# Altium schematic sheet sch_Sheet_1_2021-12-24.schdoc
size 422 x 246 mm
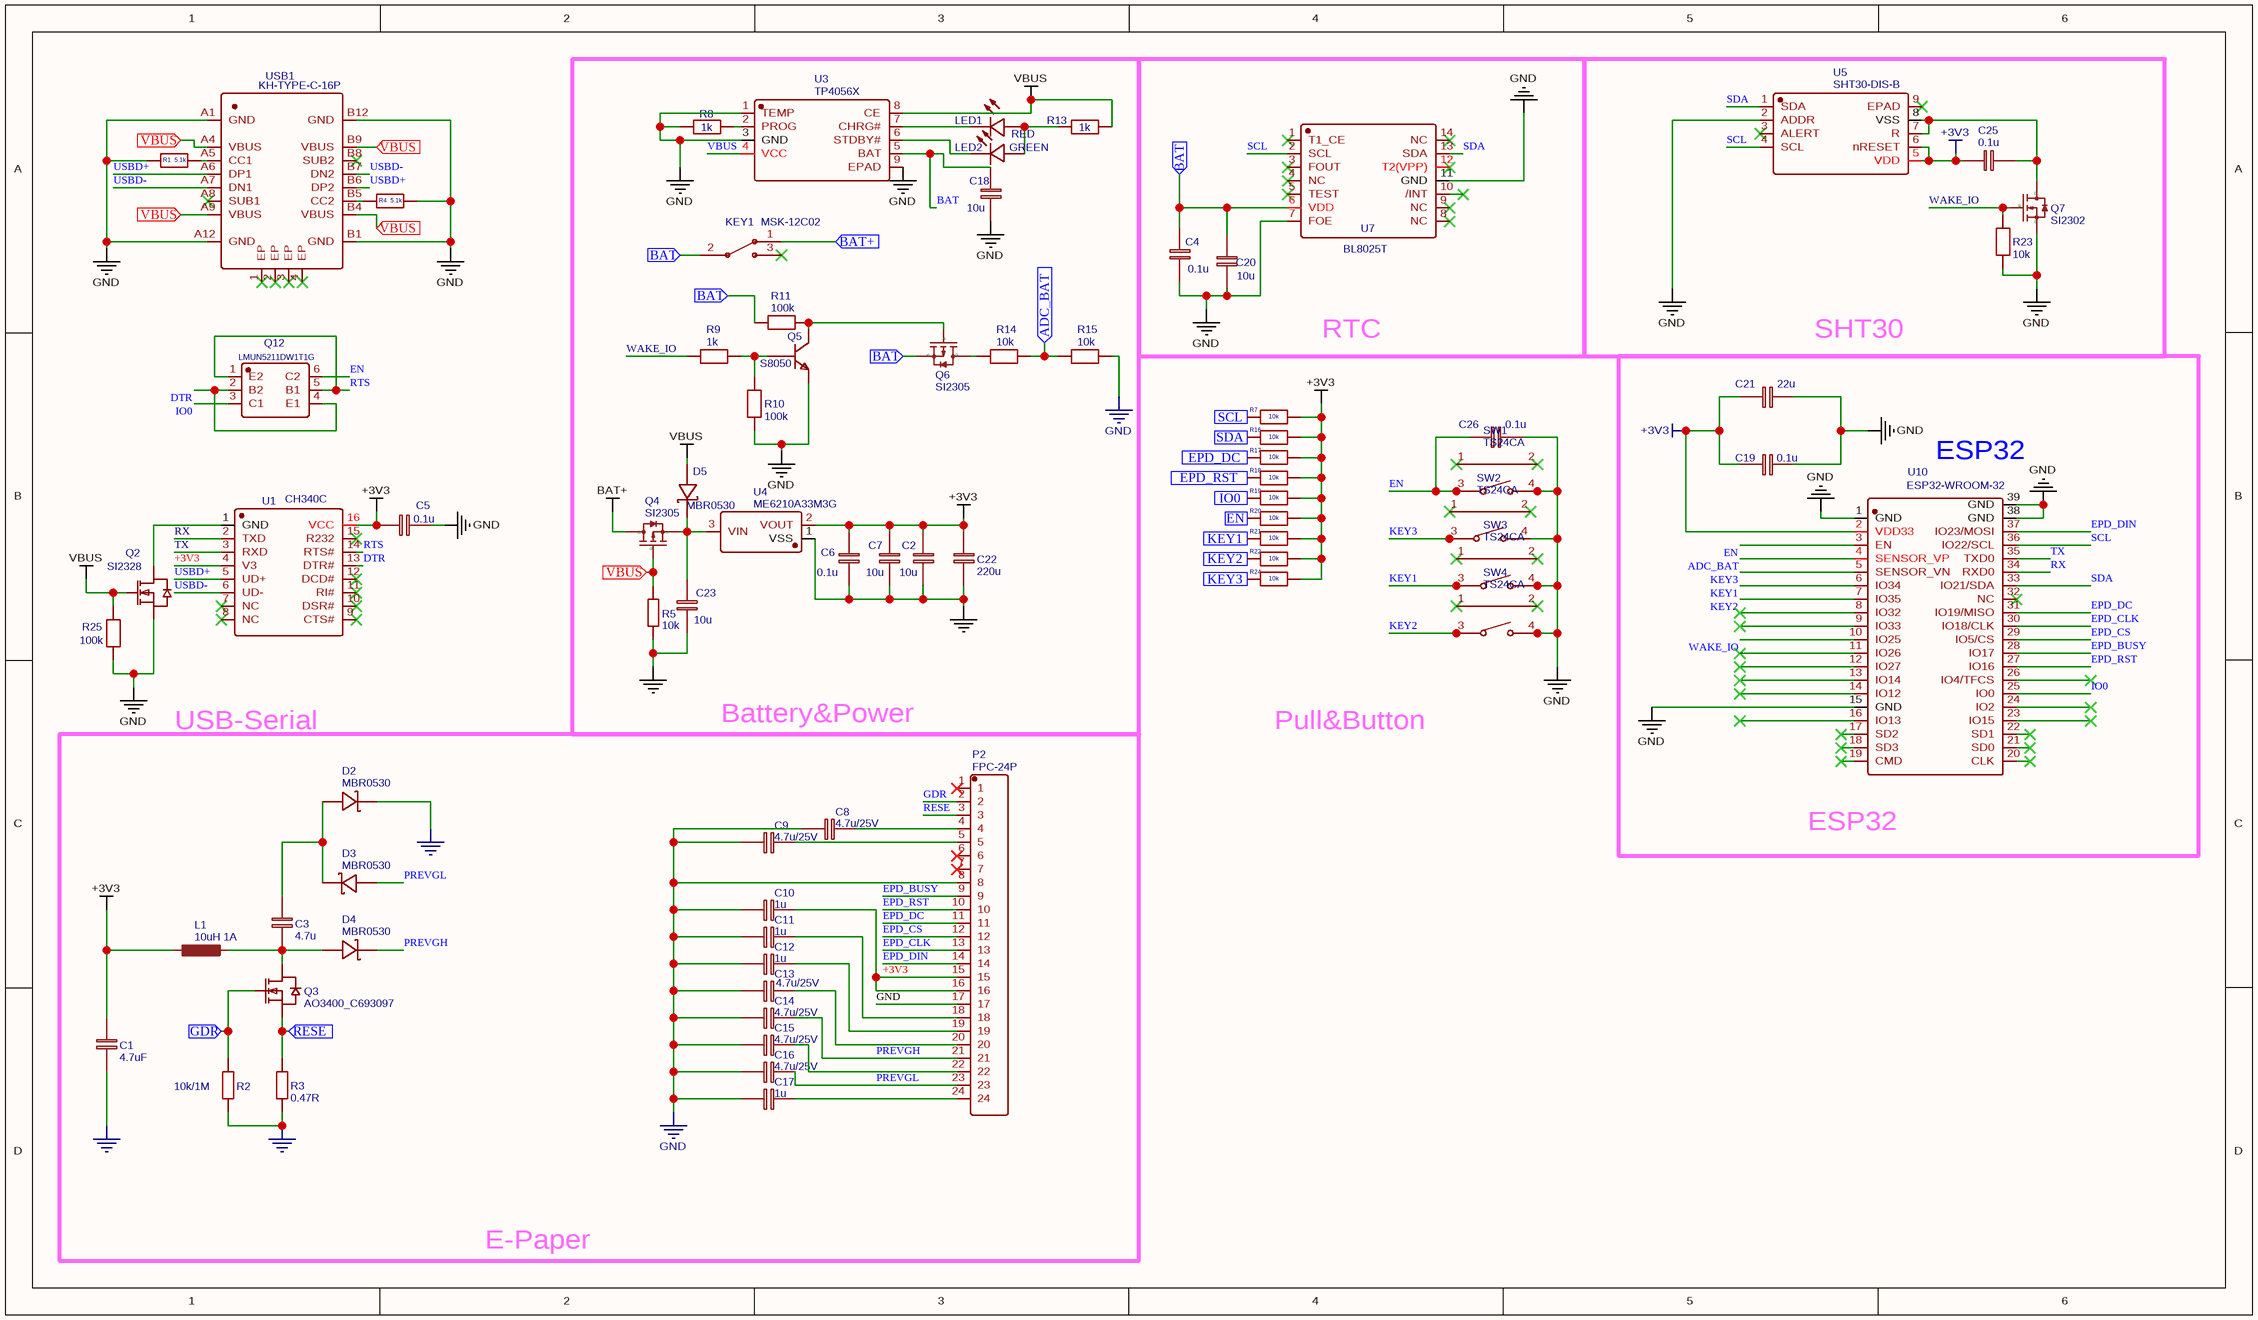
[diagram p0: sch_Sheet_1_2021-12-24.schdoc]

## Parts
C1  4.7uF  [C0603]
C2  10u  [C0603]
C3  4.7u  [C0603]
C4  0.1u  [C0603]
C5  0.1u  [C0603]
C6  0.1u  [C0603]
C7  10u  [C0603]
C8  4.7u/25V  [C0603]
C9  4.7u/25V  [C0603]
C10  1u  [C0603]
C11  1u  [C0603]
C12  1u  [C0603]
C13  4.7u/25V  [C0603]
C14  4.7u/25V  [C0603]
C15  4.7u/25V  [C0603]
C16  4.7u/25V  [C0603]
C17  1u  [C0603]
C18  10u  [C0603]
C19  0.1u  [C0603]
C20  10u  [C0603]
C21  22u  [C0603]
C22  220u  [CASE-B_3528]
C23  10u  [C0603]
C25  0.1u  [C0603]
C26  0.1u  [C0603]
D2  MBR0530  [SOD-123]
D3  MBR0530  [SOD-123]
D4  MBR0530  [SOD-123]
D5  MBR0530  [SOD-123]
KEY1  MSK-12C02  [MSK-11027]
L1  10uH 1A  [C-CD32电感]
LED1  RED  [LED0603-R-RD]
LED2  GREEN  [LED0603-R-RD]
P2  FPC-24P  [FPC-0.5MM-LSSJ-H2.0-24P]
Q2  SI2328  [SOT-23_L2.9-W1.3-P1.90-LS2.4-BR]
Q3  AO3400_C693097  [SOT-23-3_L2.9-W1.6-P1.90-LS2.8-BR]
Q4  SI2305  [SOT-23-3_L2.9-W1.3-P1.90-LS2.4-BR]
Q5  S8050  [SOT-23(SOT-23-3)]
Q6  SI2305  [SOT-23-3_L2.9-W1.3-P1.90-LS2.4-BR]
Q7  SI2302  [SOT-23-3_L2.9-W1.3-P1.90-LS2.4-BR]
Q12  LMUN5211DW1T1G  [SC-88-6_L2.0-W1.3-P0.65-LS2.1-BL]
R1  5.1k  [R0603]
R2  10k/1M  [R0603]
R3  0.47R  [R0603]
R4  5.1k  [R0603]
R5  10k  [R0603]
R7  10k  [R0603]
R8  1k  [R0603]
R9  1k  [R0603]
R10  100k  [R0603]
R11  100k  [R0603]
R13  1k  [R0603]
R14  10k  [R0603]
R15  10k  [R0603]
R16  10k  [R0603]
R17  10k  [R0603]
R18  10k  [R0603]
R19  10k  [R0603]
R20  10k  [R0603]
R21  10k  [R0603]
R22  10k  [R0603]
R23  10k  [R0603]
R24  10k  [R0603]
R25  100k  [R0603]
SW1  TS24CA  [SW-SMD_TS24CA]
SW2  TS24CA  [SW-SMD_TS24CA]
SW3  TS24CA  [SW-SMD_TS24CA]
SW4  TS24CA  [SW-SMD_TS24CA]
U1  CH340C  [SOP-16_150MIL]
U3  TP4056X  [SOP-8_L4.9-W3.9-P1.27-LS6.0-BL-EP]
U4  ME6210A33M3G  [SOT-23-3_L3.0-W1.7-P0.95-LS2.9-BR]
U5  SHT30-DIS-B  [DFN-8_L2.5-W2.5-P0.50-BL-EP]
U7  BL8025T  [SOP-14_L10.3-W5.3-P1.27-LS7.8-BL]
U10  ESP32-WROOM-32  [WIFIM-SMD_39P-L25.5-W18.0-P1.27]
USB1  KH-TYPE-C-16P  [USB-C-SMD_KH-TYPE-C-16P]

## Blocks framed on the sheet
Battery&Power: C2 C6 C7 C18 C22 C23 D5 KEY1 LED1 LED2 Q4-Q6 R5 R8-R11 R13-R15 U3 U4
RTC: C4 C20 U7
SHT30: C25 Q7 R23 U5

## Ports
ADC_BAT (in), BAT (in), BAT+ (in), EN (in), EPD_DC (in), EPD_RST (in), GDR (in), IO0 (in), KEY1 (in), KEY2 (in), KEY3 (in), RESE (in), SCL (in), SDA (in), VBUS (in)

## Nets
+3V3: C1.1 C2.1 C5.2 C6.1 C7.1 C10.1 C19.2 C21.2 C22.1 C25.1 L1.1 P2.15 P2.16 R7.2 R16.2 R17.2 R18.2 R19.2 R20.2 R21.2 R22.2 R24.2 U1.4(V3) U1.16(VCC) U4.2(VOUT) U5.5(VDD) U5.6(nRESET) U10.2(VDD33)
BAT+: Q4.3(D)
GND: C1.2 C2.2 C4.2 C5.1 C6.2 C7.2 C8.2 C9.2 C10.2 C11.2 C12.2 C13.2 C14.2 C15.2 C16.2 C17.2 C18.2 C19.1 C20.2 C21.1 C22.2 C23.2 C26.2 D2.2(K) P2.8 P2.17 Q2.2(S) Q5.2(E) Q7.2(S) R1.1 R2.2 R3.1 R4.2 R5.2 R8.2 R10.1 R15.2 R23.1 R25.1 SW1.4 SW2.4 SW3.4 SW4.4 U3.1(TEMP) U3.3(GND) U3.9(EPAD) U4.1(VSS) U5.2(ADDR) U7.7(FOE) U7.11(GND) U10.1(GND) U10.15(GND) U10.38(GND) U10.39(GND) USB1.A1(GND) USB1.A12(GND) USB1.B1(GND) USB1.B12(GND)
VBUS: D5.1(A) Q2.1(G) R13.2 R25.2 U3.4(VCC) U3.8(CE)
ADC_BAT: R14.2 R15.1 ; port ADC_BAT
ADC_BAT: U10.4(SENSOR_VP)  [a separate net that carries the same name]
BAT: C18.1 U3.5(BAT)
BAT: C4.1 C20.1 KEY1.2 Q6.2(S) R11.2 U7.6(VDD) ; port BAT  [a separate net that carries the same name]
BAT+: KEY1.1 ; port BAT+  [a separate net that carries the same name]
DTR: Q12.2(B2) Q12.4(E1) U1.13(DTR#)
EN: C26.1 Q12.6(C2) SW1.3 U10.3(EN)
EN: R20.1 ; port EN  [a separate net that carries the same name]
EPD_BUSY: P2.9 U10.28(IO17)
EPD_CLK: P2.13 U10.30(IO18/CLK)
EPD_CS: P2.12 U10.29(IO5/CS)
EPD_DC: P2.11 U10.31(IO19/MISO)
EPD_DC: R17.1 ; port EPD_DC  [a separate net that carries the same name]
EPD_DIN: P2.14 U10.37(IO23/MOSI)
EPD_RST: P2.10 U10.27(IO16)
EPD_RST: R18.1 ; port EPD_RST  [a separate net that carries the same name]
GDR: P2.2
GDR: Q3.1(G) R2.1 ; port GDR  [a separate net that carries the same name]
IO0: Q12.3(C1) U10.25(IO0)
IO0: R19.1 ; port IO0  [a separate net that carries the same name]
KEY1: SW3.3 U10.6(IO34)
KEY1: R21.1 ; port KEY1  [a separate net that carries the same name]
KEY2: SW4.3 U10.7(IO35)
KEY2: R22.1 ; port KEY2  [a separate net that carries the same name]
KEY3: SW2.3 U10.5(SENSOR_VN)
KEY3: R24.1 ; port KEY3  [a separate net that carries the same name]
PREVGH: C14.1 D4.2(K) P2.21
PREVGL: C16.1 D3.1(A) P2.23
RESE: P2.3
RESE: Q3.2(S) R3.2 ; port RESE  [a separate net that carries the same name]
RTS: Q12.1(E2) Q12.5(B1) U1.14(RTS#)
RX: U1.2(TXD) U10.34(RXD0)
SCL: U5.4(SCL) U7.2(SCL) U10.36(IO22/SCL)
SCL: R7.1 ; port SCL  [a separate net that carries the same name]
SDA: U5.1(SDA) U7.13(SDA) U10.33(IO21/SDA)
SDA: R16.1 ; port SDA  [a separate net that carries the same name]
TX: U1.3(RXD) U10.35(TXD0)
USBD+: U1.5(UD+) USB1.A6(DP1) USB1.B6(DP2)
USBD-: U1.6(UD-) USB1.A7(DN1) USB1.B7(DN2)
VBUS: Q4.1(G) R5.1 USB1.A4(VBUS) USB1.A9(VBUS) USB1.B4(VBUS) USB1.B9(VBUS) ; port VBUS  [a separate net that carries the same name]
WAKE_IO: Q7.1(G) R9.2 R23.2 U10.10(IO25)
NetC3_1: C3.1 D2.1(A) D3.2(K)
NetC3_2: C3.2 D4.1(A) L1.2 Q3.3(D)
NetC8_1: C8.1 P2.4
NetC9_1: C9.1 P2.5
NetC11_1: C11.1 P2.18
NetC12_1: C12.1 P2.19
NetC13_1: C13.1 P2.20
NetC15_1: C15.1 P2.22
NetC17_1: C17.1 P2.24
NetC23_1: C23.1 D5.2(K) Q4.2(S) U4.3(VIN)
NetC25_2: C25.2 Q7.3(D) U5.7(R) U5.8(VSS)
NetLED1_1: LED1.1(+) LED2.1(A) R13.1
NetLED1_2: LED1.2(-) U3.7(CHRG#)
NetLED2_2: LED2.2(K) U3.6(STDBY#)
NetQ2_3: Q2.3(D) U1.1(GND)
NetQ5_1: Q5.1(B) R9.1 R10.2
NetQ5_3: Q5.3(C) Q6.1(G) R11.1
NetQ6_3: Q6.3(D) R14.1
NetR1_2: R1.2 USB1.A5(CC1)
NetR4_1: R4.1 USB1.B5(CC2)
NetR8_1: R8.1 U3.2(PROG)

Not connected (* = marked no-connect by the designer): KEY1 3*; P2 1* 6* 7*; SW1 1* 2*; SW2 1* 2*; SW3 1* 2*; SW4 1* 2*; U1 7(NC)* 8(NC)* 9(CTS#)* 10(DSR#)* 11(RI#)* 12(DCD#)* 15(R232)*; U5 3(ALERT)* 9(EPAD)*; U7 1(T1_CE)* 3(FOUT)* 4(NC)* 5(TEST)* 8(NC)* 9(NC)* 10(/INT)* 12(T2(VPP))* 14(NC)*; U10 8(IO32)* 9(IO33)* 11(IO26)* 12(IO27)* 13(IO14)* 14(IO12)* 16(IO13)* 17(SD2)* 18(SD3)* 19(CMD)* 20(CLK)* 21(SD0)* 22(SD1)* 23(IO15)* 24(IO2)* 26(IO4/TFCS)* 32(NC)*; USB1 1(EP)* 2(EP)* 3(EP)* 4(EP)* A8(SUB1)* B8(SUB2)*

## Notes on the sheet
- (near U10) ESP32
- USB-Serial
- Pull&Button
- E-Paper

## Library data of the parts
C1 = 4.7uF: BOM_Manufacturer Part: CL10A475MP5LNNC; BOM_Manufacturer: Samsung Electro-Mechanics; nameAlias: Value(F); spicePre: C; spiceSymbolName: Capacitor; BOM_Supplier: LCSC; BOM_Supplier Part: C318644
C2 C7 C18 C20 C23 = 10u: BOM_Manufacturer Part: CL10A475MP5LNNC; BOM_Manufacturer: Samsung Electro-Mechanics; nameAlias: Value(F); spicePre: C; spiceSymbolName: Capacitor; BOM_Supplier: LCSC; BOM_Supplier Part: C318644
C3 = 4.7u: BOM_Manufacturer Part: CT41-0603-2F4-50V-0.1uF-M(N); BOM_Manufacturer: TORCH; nameAlias: Value(F); spicePre: C; spiceSymbolName: Capacitor; BOM_Supplier: LCSC; BOM_Supplier Part: C138344
C4-C6 C19 C26 = 0.1u: BOM_Manufacturer Part: CL10A475MP5LNNC; BOM_Manufacturer: Samsung Electro-Mechanics; nameAlias: Value(F); spicePre: C; spiceSymbolName: Capacitor; BOM_Supplier: LCSC; BOM_Supplier Part: C318644
C8 C9 C13-C16 = 4.7u/25V: nameAlias: Value(F); spicePre: C; spiceSymbolName: Capacitor
C10 = 1u: BOM_Manufacturer Part: CT41-0603-2F4-50V-0.1uF-M(N); BOM_Manufacturer: TORCH; nameAlias: Value(F); spicePre: C; spiceSymbolName: Capacitor; BOM_Supplier: LCSC; BOM_Supplier Part: C138344
C11 C12 C17 = 1u: nameAlias: Value(F); spicePre: C; spiceSymbolName: Capacitor
C21 = 22u: BOM_Manufacturer Part: CL10A475MP5LNNC; BOM_Manufacturer: Samsung Electro-Mechanics; nameAlias: Value(F); spicePre: C; spiceSymbolName: Capacitor; BOM_Supplier: LCSC; BOM_Supplier Part: C318644
C22 = 220u: BOM_Manufacturer Part: CA45-B-6.3V-100uF-K; BOM_Manufacturer: CEC; nameAlias: Value(F); spicePre: C; spiceSymbolName: Capacitor; BOM_Supplier: LCSC; BOM_Supplier Part: C129289
C25 = 0.1u: BOM_Manufacturer Part: CT41-0603-2F4-50V-0.1uF-M(N); BOM_Manufacturer: TORCH; nameAlias: Value(F); spicePre: C; spiceSymbolName: Cap_0603_EU; BOM_Supplier: LCSC; BOM_Supplier Part: C138344
KEY1 = MSK-12C02: BOM_Manufacturer: SHOU HAN; BOM_Manufacturer Part: MSK12C02; BOM_Supplier: LCSC; spicePre: K; BOM_Supplier Part: C431540
L1 = 10uH 1A: BOM_Manufacturer Part: CB2012T680K; BOM_Manufacturer: Taiyo Yuden; nameAlias: Value(H); spicePre: L; spiceSymbolName: Inductor; BOM_Supplier: LCSC; BOM_Supplier Part: C223178
LED1 = RED: BOM_Manufacturer: EKINGLUX; BOM_Manufacturer Part: E6C0603URAC1UDA; Contributor: LCSC; BOM_Supplier: LCSC; BOM_Supplier Part: C375444; spicePre: L; spiceSymbolName: E6C0603URAC1UDA
LED2 = GREEN: BOM_Manufacturer: Orient; BOM_Manufacturer Part: ORH-G36G; Contributor: LCSC; SMT Type: Extend; BOM_Supplier: LCSC; BOM_Supplier Part: C205443; BOM_JLCPCB SMD: Yes; spicePre: L; spiceSymbolName: ORH-G36G
Q2 = SI2328: BOM_Manufacturer: Bourne Semicon (Shenzhen); Contributor: LCSC; BOM_Supplier: LCSC; BOM_Supplier Part: C344007; BOM_Manufacturer Part: SI2328; BOM_JLCPCB Part Class: Extended Part; spicePre: Q; spiceSymbolName: SI2328
Q3 = AO3400_C693097: BOM_Manufacturer: VBsemi Elec; BOM_Manufacturer Part: AO3400; Contributor: LCSC; BOM_Supplier: LCSC; BOM_Supplier Part: C693097; BOM_JLCPCB Part Class: Extended Part; spicePre: Q; spiceSymbolName: AO3400_C693097
Q4 Q6 = SI2305: BOM_Manufacturer: Hottech; Contributor: LCSC; SMT Type: Extend; BOM_Supplier: LCSC; BOM_Manufacturer Part: SI2305; BOM_Supplier Part: C181088; BOM_LCSC Assembly: Yes; spicePre: Q; spiceSymbolName: SI2305
Q5 = S8050: BOM_Manufacturer: Yenji; Contributor: LCSC; SMT Type: Extend; BOM_Supplier: LCSC; BOM_Manufacturer Part: S8050; BOM_Supplier Part: C139514; BOM_LCSC Assembly: Yes; spicePre: Q
Q7 = SI2302: BOM_Manufacturer: Hottech; Contributor: LCSC; SMT Type: Extend; BOM_Supplier: LCSC; BOM_Manufacturer Part: SI2302; BOM_Supplier Part: C181087; BOM_LCSC Assembly: Yes; spicePre: Q; spiceSymbolName: SI2302
Q12 = LMUN5211DW1T1G: BOM_Manufacturer: Leshan Radio; Contributor: LCSC; BOM_Supplier: LCSC; BOM_Supplier Part: C417319; BOM_Manufacturer Part: LMUN5211DW1T1G; BOM_JLCPCB Part Class: Extended Part; spicePre: Q; spiceSymbolName: LMUN5211DW1T1G
R1 R4 = 5.1k: nameAlias: Value(Ω); Contributor: LCEDA_Lib; spicePre: R; spiceSymbolName: R_0603_EU
R2 = 10k/1M: BOM_Manufacturer Part: CRCW060310K0JNEA; BOM_Manufacturer: Vishay Intertech; nameAlias: Value(Ω); spicePre: R; spiceSymbolName: Resistor; BOM_Supplier: LCSC; BOM_Supplier Part: C169103
R3 = 0.47R: BOM_Manufacturer Part: CR0603F0R47P05; BOM_Manufacturer: Ever Ohms Tech; nameAlias: Value(Ω); spicePre: R; spiceSymbolName: Resistor; BOM_Supplier: LCSC; BOM_Supplier Part: C175657
R5 = 10k: BOM_Manufacturer Part: CRCW060310K0JNEA; BOM_Manufacturer: Vishay Intertech; nameAlias: Value(Ω); spicePre: R; spiceSymbolName: Resistor; BOM_Supplier: LCSC; BOM_Supplier Part: C169103
R7 R14 R16-R22 R24 = 10k: BOM_Manufacturer Part: RMC06034.7k5%N; BOM_Manufacturer: Tyohm; nameAlias: Value(Ω); Contributor: LCEDA_Lib; BOM_Supplier Part: C269694; BOM_Supplier: LCSC; spicePre: R; spiceSymbolName: R_0603_EU
R8 R13 = 1k: nameAlias: Value(Ω); Contributor: LCEDA_Lib; spicePre: R; spiceSymbolName: R_0603_EU
R9 = 1k: BOM_Manufacturer Part: R0603RXX102XF10LTS; BOM_Manufacturer: Shenzhen Eyang Tech Development; nameAlias: Value(Ω); Contributor: LCEDA_Lib; BOM_Supplier Part: C267568; BOM_Supplier: LCSC; spicePre: R; spiceSymbolName: R_0603_EU
R10 = 100k: BOM_Manufacturer Part: PTFR0603B100KP9; BOM_Manufacturer: ResistorToday; nameAlias: Value(Ω); Contributor: LCEDA_Lib; BOM_Supplier Part: C328419; BOM_Supplier: LCSC; spicePre: R; spiceSymbolName: R_0603_EU
R11 = 100k: BOM_Manufacturer Part: CRCW060310K0JNEA; BOM_Manufacturer: Vishay Intertech; nameAlias: Value(Ω); Contributor: LCEDA_Lib; BOM_Supplier Part: C169103; BOM_Supplier: LCSC; spicePre: R; spiceSymbolName: R_0603_EU
R15 = 10k: BOM_Manufacturer Part: R0603RXX102XF10LTS; BOM_Manufacturer: Shenzhen Eyang Tech Development; nameAlias: Value(Ω); Contributor: LCEDA_Lib; BOM_Supplier Part: C267568; BOM_Supplier: LCSC; spicePre: R; spiceSymbolName: R_0603_EU
R23 = 10k: nameAlias: Value(Ω); Contributor: LCEDA_Lib; spicePre: R; spiceSymbolName: R_0603_EU
R25 = 100k: nameAlias: Value(Ω); Contributor: LCEDA_Lib; spicePre: R; spiceSymbolName: R_0603_EU
SW1-SW4 = TS24CA: BOM_Manufacturer: SHOU HAN; Contributor: LCSC; BOM_Supplier: LCSC; BOM_Supplier Part: C393942; BOM_Manufacturer Part: TS24CA; BOM_JLCPCB Part Class: Extended Part; spicePre: S; spiceSymbolName: TS24CA
U1 = CH340C: BOM_Manufacturer: WCH; BOM_Supplier: LCSC; BOM_Manufacturer Part: CH340C; spicePre: U; BOM_Supplier Part: C84681
U3 = TP4056X: BOM_Manufacturer: Nanjing Extension Microelectronics; Contributor: LCSC; BOM_Supplier: LCSC; BOM_Supplier Part: C191323; BOM_Manufacturer Part: TP4056X; spicePre: U; spiceSymbolName: TP4056X
U4 = ME6210A33M3G: BOM_Manufacturer: Nanjing Micro One Elec; Contributor: LCSC; BOM_Supplier: LCSC; BOM_Supplier Part: C236680; BOM_Manufacturer Part: ME6210A33M3G; BOM_JLCPCB Part Class: Extended Part; spicePre: U; spiceSymbolName: ME6210A33M3G
U5 = SHT30-DIS-B: BOM_Manufacturer: Sensirion; BOM_Supplier: LCSC; BOM_Manufacturer Part: SHT30-DIS-B; image: //image.lceda.cn/szlcsc/C77361.jpg; BOM_Supplier Part: C77361; spicePre: U; spiceSymbolName: SHT30-DIS-B
U7 = BL8025T: BOM_Manufacturer: BL; BOM_Supplier: LCSC; BOM_Manufacturer Part: BL8025T; BOM_Supplier Part: C79083; BOM_JLCPCB Part Class: Extended Part; spicePre: U; spiceSymbolName: BL8025T
U10 = ESP32-WROOM-32: BOM_Manufacturer: Espressif Systems; Contributor: LCSC; BOM_Supplier: LCSC; BOM_Supplier Part: C503587; BOM_Manufacturer Part: ESP32-WROOM-32; spicePre: U; spiceSymbolName: ESP32-WROOM-32
USB1 = KH-TYPE-C-16P: BOM_Manufacturer: Shenzhen Kinghelm Elec; Contributor: LCSC; BOM_Supplier: LCSC; BOM_Supplier Part: C709357; BOM_Manufacturer Part: KH-TYPE-C-16P; spicePre: U; spiceSymbolName: KH-TYPE-C-16P
D2-D5 = MBR0530: BOM_Supplier: LCSC; BOM_Manufacturer Part: MBR0530; spicePre: D; BOM_Supplier Part: C77336
P2 = FPC-24P: spicePre: X; BOM_Supplier: LCSC; BOM_Manufacturer Part: ?; BOM_Supplier Part: C11092